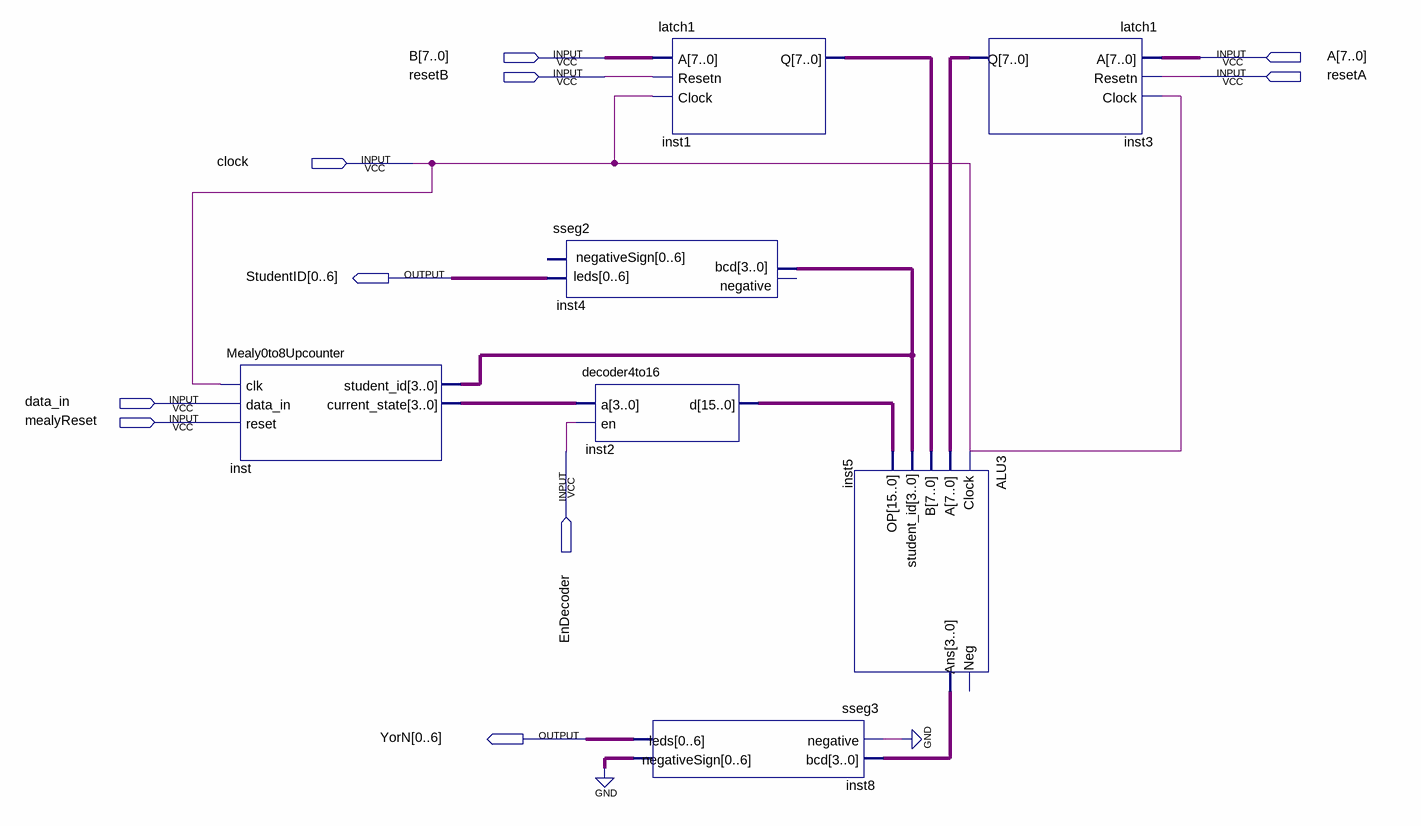
[diagram p0: schematic sheet]
// Quartus schematic part3GPU.bdf as structural Verilog: 7 symbols, 10 pins
module part3GPU (
  input  [7:0] B,
  input  [7:0] A,
  input  resetB,
  input  resetA,
  input  clock,
  input  data_in,
  input  mealyReset,
  input  EnDecoder,
  output [0:6] StudentID,
  output [0:6] YorN
);

  wire [3:0] inst5_ans, inst_current_state, inst_student_id;
  wire [6:0] inst8_negativesign;
  wire [7:0] inst1_q, inst3_q;
  wire [15:0] inst2_d;

  Mealy0to8Upcounter inst (
    .clk(clock), .data_in(data_in), .reset(mealyReset), .student_id(inst_student_id),
    .current_state(inst_current_state));
  sseg2 inst4 (.bcd(inst_student_id), .leds(StudentID));  // open: negative, negativeSign
  decoder4to16 inst2 (.a(inst_current_state), .en(EnDecoder), .d(inst2_d));
  latch1 inst1 (.A(B), .Resetn(resetB), .Clock(clock), .Q(inst1_q));
  sseg3 inst8 (.negative(1'b0), .bcd(inst5_ans), .leds(YorN), .negativeSign(inst8_negativesign));
  ALU3 inst5 (
    .Clock(clock), .A(inst3_q), .B(inst1_q), .student_id(inst_student_id), .OP(inst2_d), .Ans(inst5_ans));  // open: Neg
  latch1 inst3 (.A(A), .Resetn(resetA), .Clock(clock), .Q(inst3_q));
  // also tied to GND on the sheet: {inst8_negativesign[0], inst8_negativesign[1], inst8_negativesign[2], inst8_negativesign[3], inst8_negativesign[4], inst8_negativesign[5], inst8_negativesign[6]}
endmodule
